# Altium schematic sheet Power.SchDoc
size A3
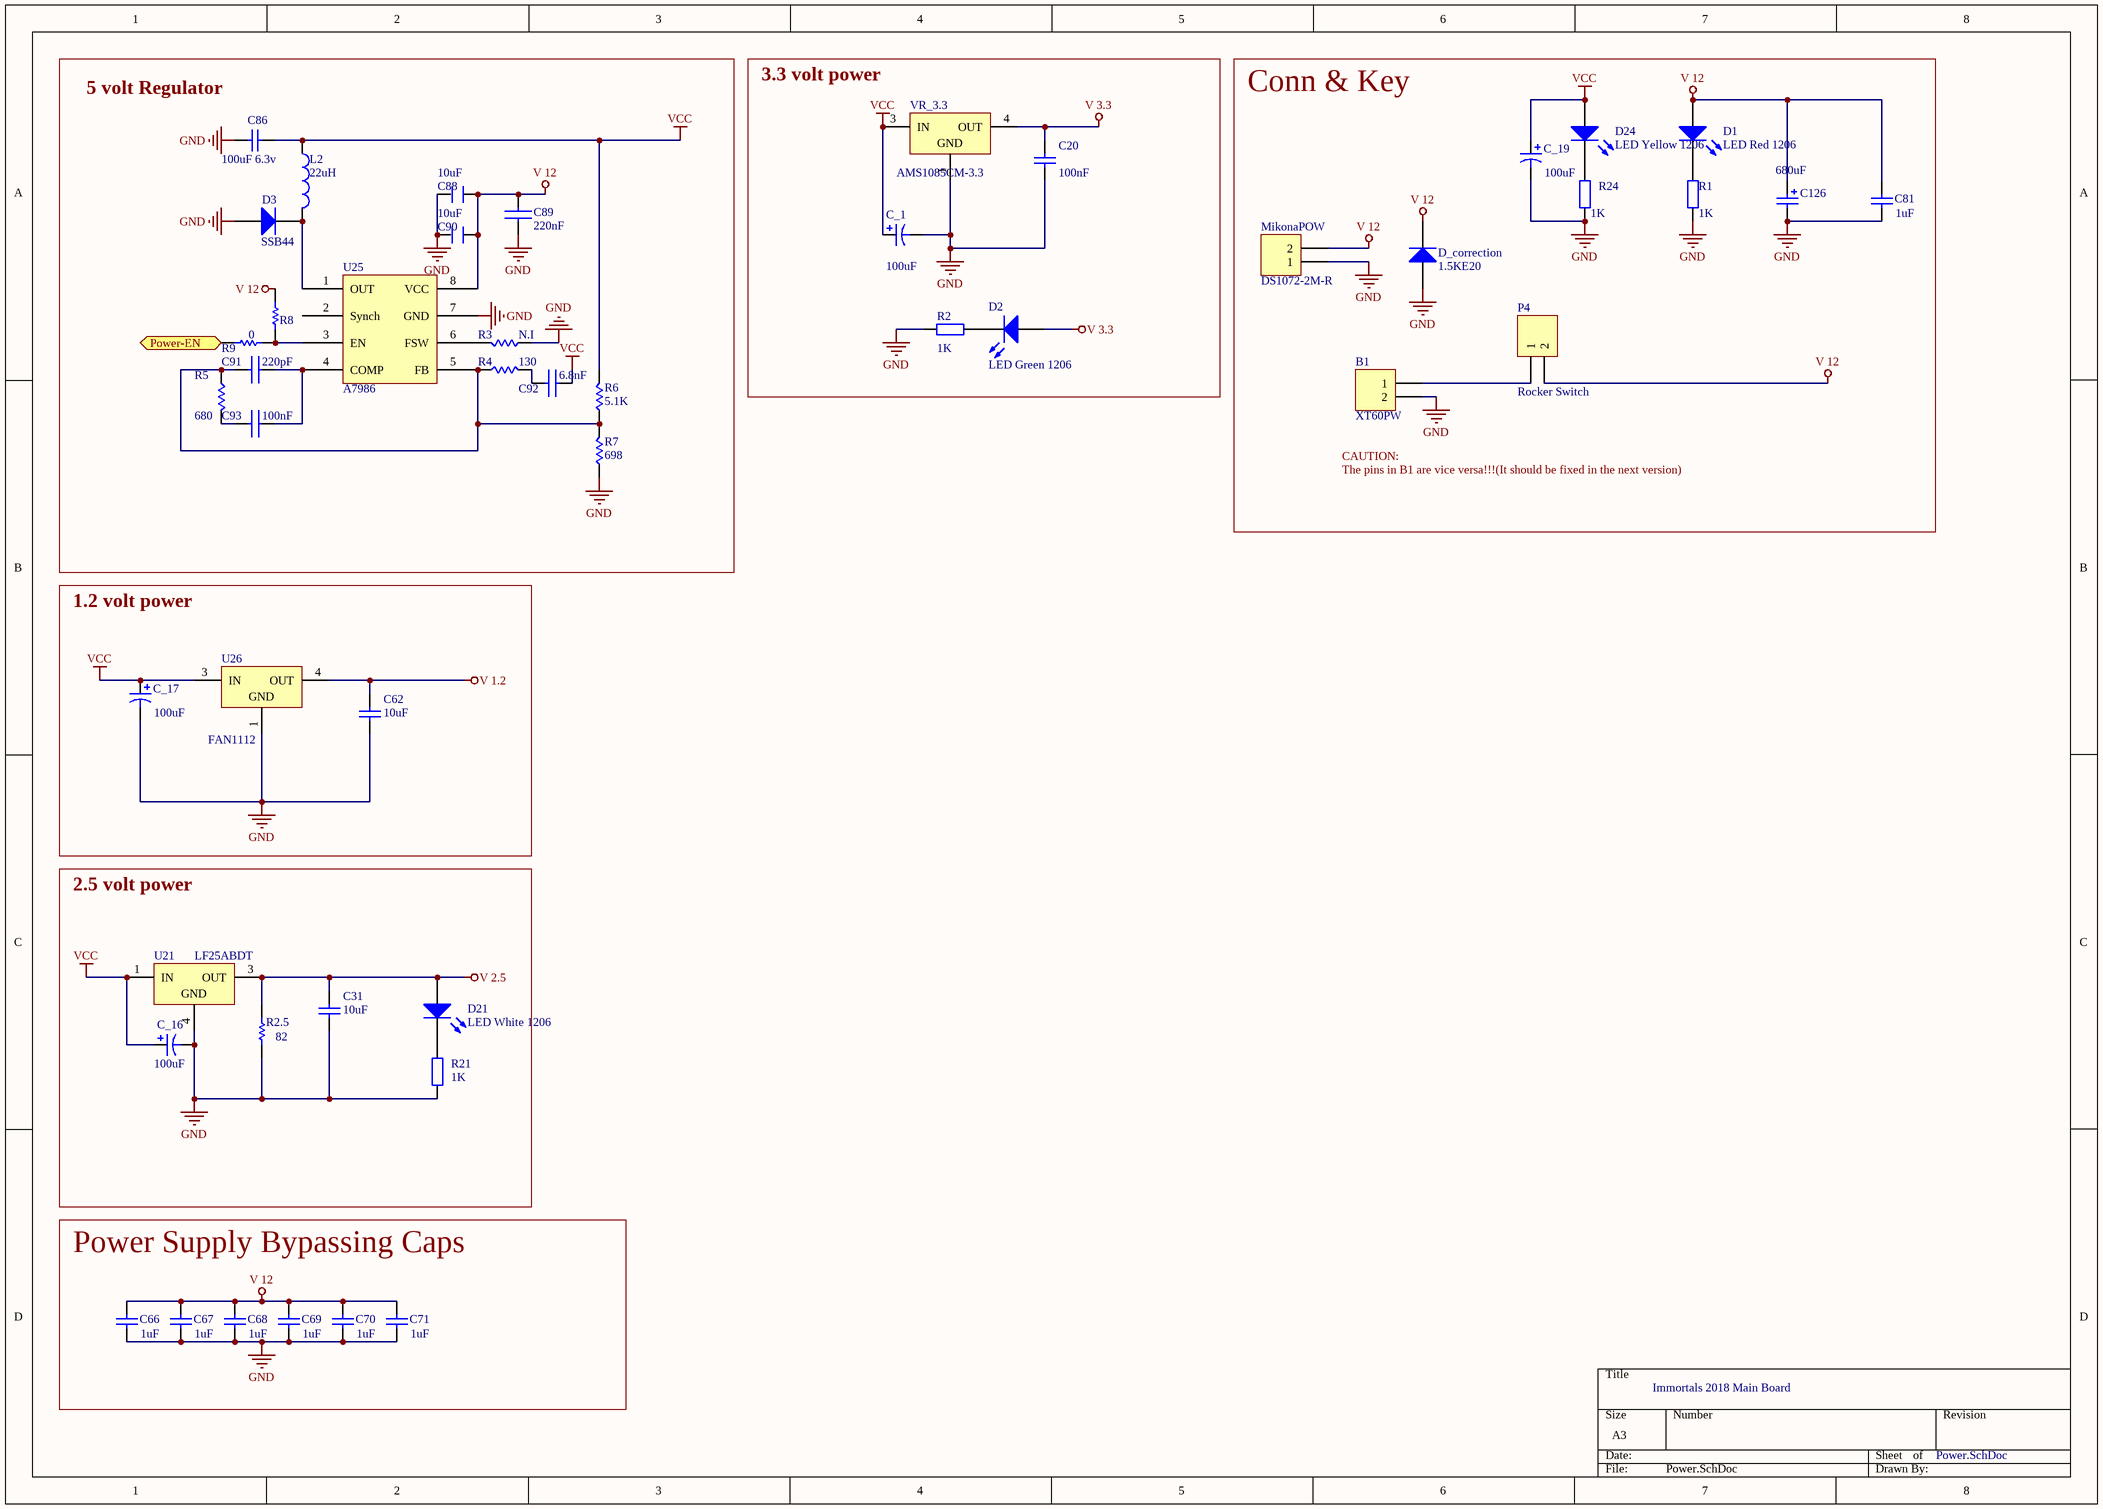
[diagram p0: Power.SchDoc]

## Parts
B1  XT60PW  [XT60PW]
C20  value 100nF  [C1206]  (hidden comment: Cap 100nF 1206)
C31  value 10uF  [C1206]  (hidden comment: Cap 10uF 1206)
C62  value 10uF  [C1206]  (hidden comment: Cap 10uF 1206)
C66  value 1uF  [C0805]  (hidden comment: Cap 1uF 0805)
C67  value 1uF  [C0805]  (hidden comment: Cap 1uF 0805)
C68  value 1uF  [C0805]  (hidden comment: Cap 1uF 0805)
C69  value 1uF  [C0805]  (hidden comment: Cap 1uF 0805)
C70  value 1uF  [C0805]  (hidden comment: Cap 1uF 0805)
C71  value 1uF  [C0805]  (hidden comment: Cap 1uF 0805)
C81  value 1uF  [C0805]  (hidden comment: Cap 1uF 0805)
C86  value 100uF 6.3v  [C1210]  (hidden comment: Cap 100uF 1210)
C88  value 10uF  [C[0805]]  (hidden comment: Cap 10uF 0805)
C89  value 220nF  [C0603]  (hidden comment: Cap 220nF 0603)
C90  value 10uF  [C[0805]]  (hidden comment: Cap 10uF 0805)
C91  value 220pF  [C0603]  (hidden comment: Cap 220pF 0603)
C92  value 6.8nF  [C0603]  (hidden comment: Cap 6.8nF 0603)
C93  value 100nF  [C0603]  (hidden comment: Cap 100nF 0603)
C126  value 680uF  [CAPPR5-5x5]  (hidden comment: Cap 680uF dip)
C_1  value 100uF  [6332[2512]]  (hidden comment: Cap 100uF 2512)
C_16  value 100uF  [6332[2512]]  (hidden comment: Cap 100uF 2512)
C_17  value 100uF  [6332[2512]]  (hidden comment: Cap 100uF 2512)
C_19  value 100uF  [6332[2512]]  (hidden comment: Cap 100uF 2512)
D1  LED Red 1206  [3.2X1.6X1.1 - RED]
D2  LED Green 1206  [3.2X1.6X1.1 - GREEN]
D3  SSB44  [DIOM4336X24N]
D21  LED White 1206  [3.2X1.6X1.1 - WHITE]
D24  LED Yellow 1206  [3.2X1.6X1.1 - YELLOW]
D_correction  1.5KE20  [DO-41]
L2  value 22uH  [INDP110100X50N]  (hidden comment: Inductor 22uH)
MikonaPOW  DS1072-2M-R  [DS1072-2M&F-R]
P4  Rocker Switch  [Rocker_SW]
R1  value 1K  [2012[0805]]  (hidden comment: Res 1K 0805)
R2  value 1K  [2012[0805]]  (hidden comment: Res 1K 0805)
R2.5  value 82  [3216[1206]]  (hidden comment: Res 82 1206)
R3  N.I  [R0603]
R4  value 130  [R0603]  (hidden comment: Res 130 0603)
R5  value 680  [R0603]  (hidden comment: Res 680 0603)
R6  value 5.1K  [R0603]  (hidden comment: Res 5.1K 0603)
R7  value 698  [R0603]  (hidden comment: Res 698 0603)
R8  N.I  [R0603]  (value not drawn)
R9  value 0  [R0603]  (hidden comment: Res 0 0603)
R21  value 1K  [2012[0805]]  (hidden comment: Res 1K 0805)
R24  value 1K  [2012[0805]]  (hidden comment: Res 1K 0805)
U21  LF25ABDT  [TO-252]
U25  A7986  [HSOP8]
U26  FAN1112  [TO-252]
VR_3.3  AMS1085CM-3.3  [936-03]

## Blocks framed on the sheet
5 volt Regulator: C86 C88-C93 D3 L2 R3-R9 U25
3.3 volt power: C20 C_1 D2 R2 VR_3.3
Conn & Key: B1 C81 C126 C_19 D1 D24 D_correction MikonaPOW P4 R1 R24
1.2 volt power: C62 C_17 U26
2.5 volt power: C31 C_16 D21 R2.5 R21 U21
Power Supply Bypassing Caps: C66-C71

## Ports
Power-EN (in)

## Nets
GND: B1.2 C20.2 C31.1 C62.1 C66.2 C67.2 C68.2 C69.2 C70.2 C71.2 C81.2 C86.1 C88.2 C89.2 C90.2 C126.2 C_1.2 C_16.2 C_17.2 C_19.2 D3.2(A) D_correction.1(A) MikonaPOW.1 R1.2 R2.1 R2.5.1 R3.1 R7.1 R21.1 R24.1 U21.4(GND) U25.7(GND) U26.1(GND) VR_3.3.1(GND)
V 1.2: C62.2 U26.4(OUT)
V 2.5: C31.2 D21.1(A) R2.5.2 U21.3(OUT)
V 3.3: C20.1 D2.1(A) VR_3.3.4(OUT)
V 12: C66.1 C67.1 C68.1 C69.1 C70.1 C71.1 C81.1 C88.1 C89.1 C90.1 C126.1 D1.1(A) D_correction.2(K) MikonaPOW.2 P4.2 R8.1 U25.8(VCC)
VCC: C86.2 C92.1 C_1.1 C_16.1 C_17.1 C_19.1 D24.1(A) L2.1 R6.2 U21.1(IN) U26.3(IN) VR_3.3.3(IN)
Power-EN: R9.1 ; port Power-EN
NetB1_1: B1.1 P4.1
NetC91_1: C91.1 R4.1 R5.1 R6.1 R7.2 U25.5(FB)
NetC91_2: C91.2 C93.2 U25.4(COMP)
NetC92_2: C92.2 R4.2
NetC93_1: C93.1 R5.2
NetD1_2: D1.2(K) R1.1
NetD2_2: D2.2(K) R2.2
NetD3_1: D3.1(K) L2.2 U25.1(OUT)
NetD21_2: D21.2(K) R21.2
NetD24_2: D24.2(K) R24.2
NetR3_2: R3.2 U25.6(FSW)
NetR8_2: R8.2 R9.2 U25.3(EN)

Not connected (* = marked no-connect by the designer): U25 2(Synch)

## Notes on the sheet
- The pins in B1 are vice versa!!!(It should be fixed in the next version)
- CAUTION:
- Immortals 2018 Main Board

## Library data of the parts
B1 = XT60PW: Power Connector; LatestRevisionDate: 17-Jul-2002; LatestRevisionNote: Re-released for DXP Platform.; Publisher: Altium Limited
C20 C31 C62 C86 = Cap Semi: Capacitor (Semiconductor SIM Model); Published: 8-Jun-2000; PackageReference: C1206; Publisher: Altium Limited
  C20 C31 C62: LatestRevisionDate: 17-Jul-2002; LatestRevisionNote: Re-released for DXP Platform.
  C86: LatestRevisionDate: 29-May-2009; LatestRevisionNote: IPC-7351 Footprint Added.; PackageDescription: Chip Capacitor
C66-C71 C81 = CAP: Capacitor; Fitted: True
C88 C90 = C: Cap , SMD; Part Field 1: 2064
C89 C91 C92 = Cap 0603: C0603
C93 = Cap 0603: Cap SMD 0603
C126 = Cap Pol1: Polarized Capacitor (Radial); Published: 8-Jun-2000; LatestRevisionDate: 17-Jul-2002; LatestRevisionNote: Re-released for DXP Platform.; PackageReference: RB7.6-15; Publisher: Altium Limited
C_1 C_16 C_17 C_19 = Cap Pol3: Polarized Capacitor (Surface Mount); Published: 8-Jun-2000; LatestRevisionDate: 17-Jul-2002; LatestRevisionNote: Re-released for DXP Platform.; PackageReference: C0805; Publisher: Altium Limited
D1 D2 D21 D24 = LED2: Typical RED, GREEN, YELLOW, AMBER GaAs LED; Published: 8-Jun-2000; LatestRevisionDate: 17-Jul-2002; LatestRevisionNote: Re-released for DXP Platform.; PackageDocument: Feb-2002; PackageReference: 3.2X1.6X1.1; Publisher: Altium Limited
D3 = Diode SSB44: 1 Amp General Purpose Rectifier; Published: 8-Jun-2000; LatestRevisionDate: 17-Jul-2002; LatestRevisionNote: Re-released for DXP Platform.; DatasheetDocument: 1998; PackageDocument: Aug-1999; PackageReference: DO-41; Publisher: Altium Limited; Code_JEDEC: DO-204-AL; ComponentLink1Description: Manufacturer Link; ComponentLink1URL: http://www.fairchildsemi.com/; ComponentLink2Description: Datasheet; ComponentLink2URL: http://www.fairchildsemi.com/ds/1N%2F1N4001.pdf
D_correction = Diode 1N4001: 1 Amp General Purpose Rectifier; Published: 8-Jun-2000; LatestRevisionDate: 17-Jul-2002; LatestRevisionNote: Re-released for DXP Platform.; DatasheetDocument: 1998; PackageDocument: Aug-1999; PackageReference: DO-41; Publisher: Altium Limited; Code_JEDEC: DO-204-AL; ComponentLink1Description: Manufacturer Link; ComponentLink1URL: http://www.fairchildsemi.com/; ComponentLink2Description: Datasheet; ComponentLink2URL: http://www.fairchildsemi.com/ds/1N%2F1N4001.pdf
L2 = 7447714220 WE-PD SMD
MikonaPOW = Header 2: Right Angle 3.96mm Power pin; LatestRevisionDate: 17-Jul-2002; LatestRevisionNote: Re-released for DXP Platform.; Publisher: Altium Limited; Value: DS1072-2M-R
P4 = Rocker_SW: I/O Power Switch; LatestRevisionDate: 17-Jul-2002; LatestRevisionNote: Re-released for DXP Platform.; Publisher: Altium Limited
R1 R2 R21 R24 = Res2: Resistor; Published: 8-Jun-2000; LatestRevisionDate: 17-Jul-2002; LatestRevisionNote: Re-released for DXP Platform.; PackageReference: AXIAL-0.4; Publisher: Altium Limited
R2.5 = Res Semi: Semiconductor Resistor; Published: 8-Jun-2000; LatestRevisionDate: 17-Jul-2002; LatestRevisionNote: Re-released for DXP Platform.; PackageReference: AXIAL-0.5; Publisher: Altium Limited
R3-R7 = Res 0603
  R3: Value: N.I
R8 R9 = R0603: Res 0603; Part Field 1: 3144
  R8: Value: N.I
U21 = LF25ABDT: 500mA, Very Low Drop (0.45V) Voltage Regulator; Published: 24-Aug-2001; LatestRevisionDate: 06-Jun-2005; LatestRevisionNote: PCB pads lengthened.; DatasheetVersion: Feb-2004; PackageVersion: Jun-2004; PackageReference: TO-252; Publisher: Altium Limited; PackageDescription: D-PAK/TO-252-AA; 3 Leads (1 Cropped); Body 10.1 (inc. leads) x 6.6 mm (LxW max); ComponentLink1Description: Manufacturer Link; ComponentLink1URL: http://www.st.com/; ComponentLink2Description: Datasheet; ComponentLink2URL: http://www.st.com/stonline/books/pdf/docs/2574.pdf
U25 = A7986: DC\DC Regulator
U26 = FAN1112: 500mA, Very Low Drop (0.45V) Voltage Regulator; Published: 24-Aug-2001; LatestRevisionDate: 06-Jun-2005; LatestRevisionNote: PCB pads lengthened.; DatasheetVersion: Feb-2004; PackageVersion: Jun-2004; PackageReference: TO-252; Publisher: Altium Limited; PackageDescription: D-PAK/TO-252-AA; 3 Leads (1 Cropped); Body 10.1 (inc. leads) x 6.6 mm (LxW max); ComponentLink1Description: Manufacturer Link; ComponentLink1URL: http://www.st.com/; ComponentLink2Description: Datasheet; ComponentLink2URL: http://www.st.com/stonline/books/pdf/docs/2574.pdf
VR_3.3 = LT1585ACM-1.5: 5A Low Dropout Fast Response Positive Fixed Voltage Regulator; Published: 15-Apr-2002; DatasheetVersion: 1999; PackageVersion: 1997; PackageReference: 936-03; Publisher: Altium Limited; PackageDescription: D2-PAK/TO-263-AB; 3 Leads (1 Cropped); Body 14.7 (inc. leads) x 10.2 mm (LxW max); ComponentLink1Description: Manufacturer Link; ComponentLink1URL: http://www.onsemi.com/site/products/taxonomy/0,4438,503,00.html